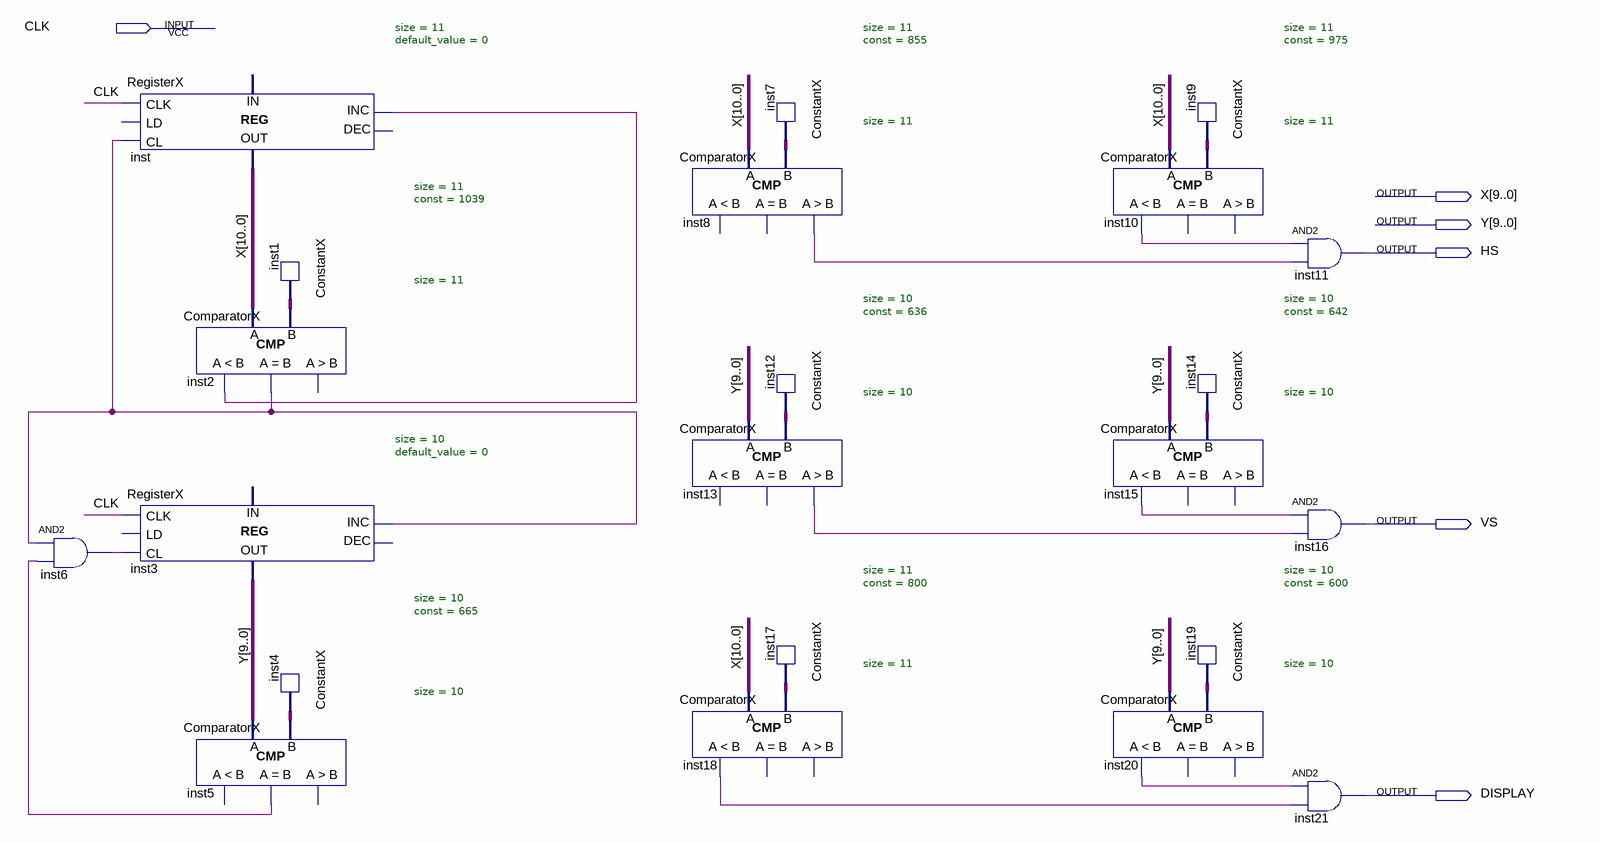
[diagram p0: schematic sheet]
// Quartus schematic Controller2.bdf as structural Verilog: 22 symbols, 6 pins
module Controller2 (
  input  CLK,
  output [10:0] X,
  output [9:0] Y,
  output HS,
  output VS,
  output DISPLAY
);

  wire inst2_eq, inst2_ls, inst5_eq, inst6_out, inst8_gr, inst10_ls, inst13_gr, inst15_ls, inst18_ls,
       inst20_ls;
  wire [9:0] inst4_data_out, inst12_data_out, inst14_data_out, inst19_data_out;
  wire [10:0] inst1_data_out, inst7_data_out, inst9_data_out, inst17_data_out;

  and inst6 (inst6_out, inst2_eq, inst5_eq);
  RegisterX #(.size(11), .default_value(0)) inst (
    .CLK(CLK), .CL(inst2_eq), .INC(inst2_ls), .DATA_OUT(X));  // open: LD, DEC, DATA_IN
  RegisterX #(.size(10), .default_value(0)) inst3 (
    .CLK(CLK), .CL(inst6_out), .INC(inst2_eq), .DATA_OUT(Y));  // open: LD, DEC, DATA_IN
  ComparatorX #(.size(11)) inst2 (.A(X), .B(inst1_data_out), .LS(inst2_ls), .EQ(inst2_eq));  // open: GR
  ComparatorX #(.size(10)) inst5 (.A(Y), .B(inst4_data_out), .EQ(inst5_eq));  // open: LS, GR
  ConstantX #(.size(11), .\const (1039)) inst1 (.DATA_OUT(inst1_data_out));
  ConstantX #(.size(10), .\const (665)) inst4 (.DATA_OUT(inst4_data_out));
  ComparatorX #(.size(11)) inst8 (.A(X), .B(inst7_data_out), .GR(inst8_gr));  // open: LS, EQ
  ComparatorX #(.size(10)) inst13 (.A(Y), .B(inst12_data_out), .GR(inst13_gr));  // open: LS, EQ
  ComparatorX #(.size(11)) inst18 (.A(X), .B(inst17_data_out), .LS(inst18_ls));  // open: EQ, GR
  ConstantX #(.size(11), .\const (855)) inst7 (.DATA_OUT(inst7_data_out));
  ConstantX #(.size(10), .\const (636)) inst12 (.DATA_OUT(inst12_data_out));
  ConstantX #(.size(11), .\const (800)) inst17 (.DATA_OUT(inst17_data_out));
  ComparatorX #(.size(11)) inst10 (.A(X), .B(inst9_data_out), .LS(inst10_ls));  // open: EQ, GR
  ComparatorX #(.size(10)) inst15 (.A(Y), .B(inst14_data_out), .LS(inst15_ls));  // open: EQ, GR
  ComparatorX #(.size(10)) inst20 (.A(Y), .B(inst19_data_out), .LS(inst20_ls));  // open: EQ, GR
  ConstantX #(.size(11), .\const (975)) inst9 (.DATA_OUT(inst9_data_out));
  ConstantX #(.size(10), .\const (642)) inst14 (.DATA_OUT(inst14_data_out));
  ConstantX #(.size(10), .\const (600)) inst19 (.DATA_OUT(inst19_data_out));
  and inst11 (HS, inst10_ls, inst8_gr);
  and inst16 (VS, inst15_ls, inst13_gr);
  and inst21 (DISPLAY, inst20_ls, inst18_ls);
endmodule
